# Altium schematic sheet FPGA_Config_Flash.SchDoc
size A
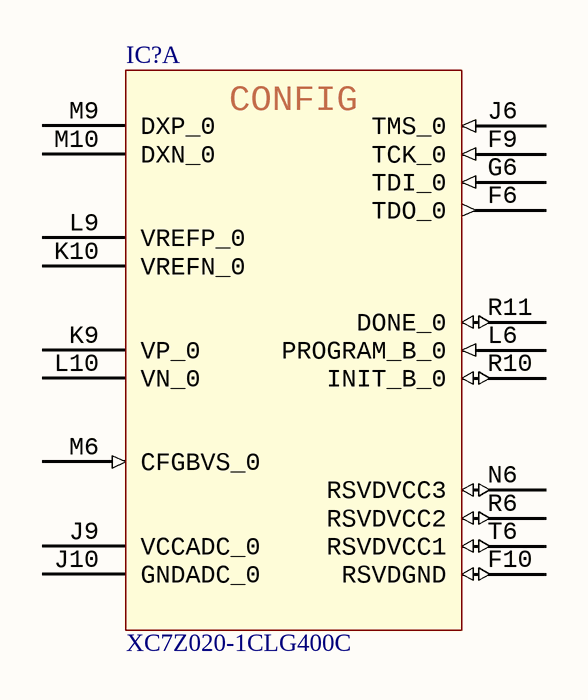
[diagram p0: FPGA_Config_Flash.SchDoc]

## Parts
IC?  XC7Z020-1CLG400C  [BGA400]  (part A of 9)

## Nets

Not connected (* = marked no-connect by the designer): IC? F6(TDO_0) F9(TCK_0) F10(RSVDGND) G6(TDI_0) J6(TMS_0) J9(VCCADC_0) J10(GNDADC_0) K9(VP_0) K10(VREFN_0) L6(PROGRAM_B_0) L9(VREFP_0) L10(VN_0) M6(CFGBVS_0) M9(DXP_0) M10(DXN_0) N6(RSVDVCC3) R6(RSVDVCC2) R10(INIT_B_0) R11(DONE_0) T6(RSVDVCC1)

## Notes on the sheet
- (in symbol XC7Z020-1CLG400C, part A) CONFIG

## Library data of the parts
IC? = XC7Z020-1CLG400C: Zynq-7000 SoC.; ComponentLink1Description: Digi-Key; ComponentLink1URL: https://www.digikey.com/product-detail/en/xilinx-inc/XC7Z020-1CLG400C/122-1851-ND/3925758?utm_adgroup=Integrated Circuits&slid=&gclid=Cj0KCQjwn_LrBRD4ARIsAFEQFKtYXIOPieaS_xsLL2AvFALkVw3M5siD0KQOWM0owpA_yiQuHKATBqcaAuQ6EALw_wcB